# Altium project STM32板.PrjPcb
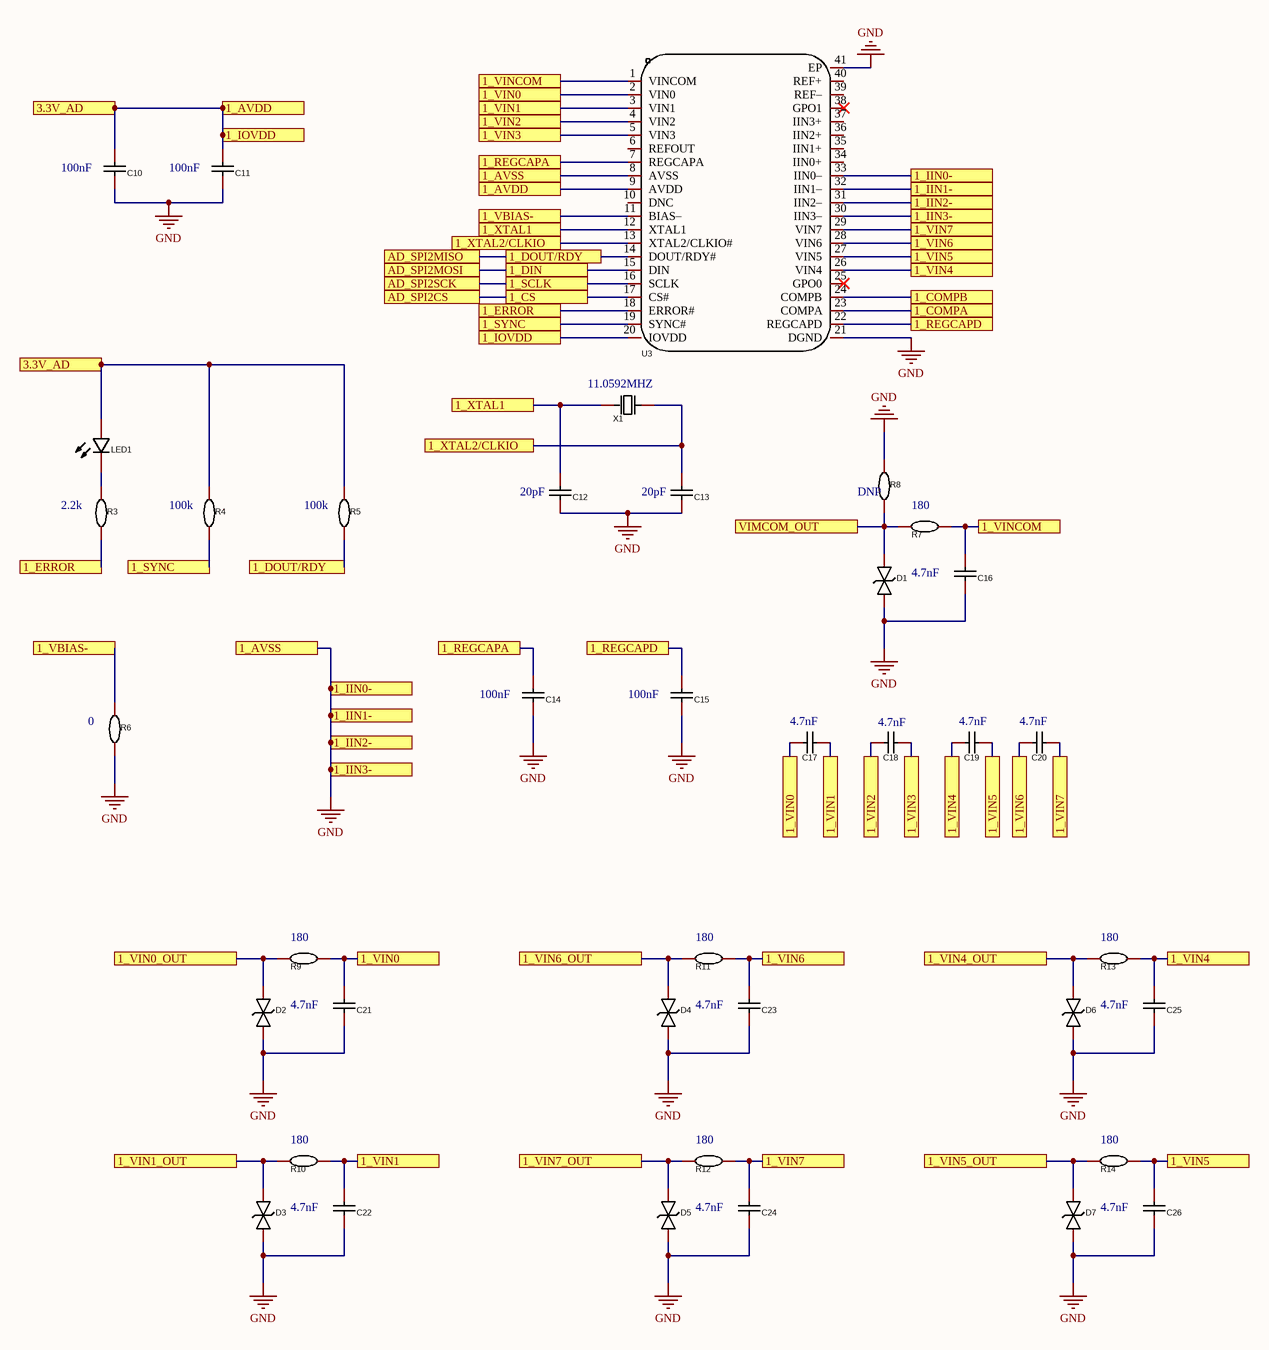
[diagram p0: AD4111_1.SchDoc]
3 sheets, 108 parts. Net scope: flat (ports and power ports of the same name join across sheets).
Board file: PCB1.PcbDoc
Sheets:
  AD4111_1.SchDoc
  AD4111_2.SchDoc
  STM32.SchDoc

## Sheet AD4111_1.SchDoc
size A3; SheetNumber: 1; SheetTotal: 3

### Parts
C10  100nF  [C0603]
C11  100nF  [C0603]
C12  20pF  [C0603]
C13  20pF  [C0603]
C14  100nF  [C0603]
C15  100nF  [C0603]
C16  4.7nF  [C0603]
C17  4.7nF  [C0603]
C18  4.7nF  [C0603]
C19  4.7nF  [C0603]
C20  4.7nF  [C0603]
C21  4.7nF  [C0603]
C22  4.7nF  [C0603]
C23  4.7nF  [C0603]
C24  4.7nF  [C0603]
C25  4.7nF  [C0603]
C26  4.7nF  [C0603]
D1  SMAJ33CA_C908829  [SMA_L4.4-W2.8-LS5.1-BI]  (value not drawn)
D2  SMAJ33CA_C908829  [SMA_L4.4-W2.8-LS5.1-BI]  (value not drawn)
D3  SMAJ33CA_C908829  [SMA_L4.4-W2.8-LS5.1-BI]  (value not drawn)
D4  SMAJ33CA_C908829  [SMA_L4.4-W2.8-LS5.1-BI]  (value not drawn)
D5  SMAJ33CA_C908829  [SMA_L4.4-W2.8-LS5.1-BI]  (value not drawn)
D6  SMAJ33CA_C908829  [SMA_L4.4-W2.8-LS5.1-BI]  (value not drawn)
D7  SMAJ33CA_C908829  [SMA_L4.4-W2.8-LS5.1-BI]  (value not drawn)
LED1  NCD0603R1_C84263  [LED0603-RD_RED]  (value not drawn)
R3  2.2k  [R0603]
R4  100k  [R0603]
R5  100k  [R0603]
R6  0  [R0603]
R7  180  [R0603]
R8  DNP  [R0603]
R9  180  [R0603]
R10  180  [R0603]
R11  180  [R0603]
R12  180  [R0603]
R13  180  [R0603]
R14  180  [R0603]
U3  AD4111BCPZ  [LFCSP-40_L6.0-W6.0-P0.50-TL-EP4.6]  (value not drawn)
X1  11.0592MHZ  [OSC-SMD_L5.0-W3.2]

### Ports
1_AVDD, 1_AVSS, 1_COMPA, 1_COMPB, 1_CS, 1_DIN, 1_DOUT/RDY, 1_ERROR, 1_IIN0-, 1_IIN1-, 1_IIN2-, 1_IIN3-, 1_IOVDD, 1_REGCAPA, 1_REGCAPD, 1_SCLK, 1_SYNC, 1_VBIAS-, 1_VIN0, 1_VIN0_OUT, 1_VIN1, 1_VIN1_OUT, 1_VIN2, 1_VIN3, 1_VIN4, 1_VIN4_OUT, 1_VIN5, 1_VIN5_OUT, 1_VIN6, 1_VIN6_OUT, 1_VIN7, 1_VIN7_OUT, 1_VINCOM, 1_XTAL1, 1_XTAL2/CLKIO, 3.3V_AD, AD_SPI2CS, AD_SPI2MISO, AD_SPI2MOSI, AD_SPI2SCK, VIMCOM_OUT

### Nets
3.3V: C10.2 C11.2 LED1.2(A) R4.2 R5.2 U3.9(AVDD) U3.20(IOVDD) ; port 1_AVDD, port 1_IOVDD, port 3.3V_AD
GND: C10.1 C11.1 C12.1 C13.1 C14.1 C15.1 C16.1 C21.1 C22.1 C23.1 C24.1 C25.1 C26.1 D1.2 D2.2 D3.2 D4.2 D5.2 D6.2 D7.2 R6.1 R8.2 U3.8(AVSS) U3.21(DGND) U3.30(IIN3–) U3.31(IIN2–) U3.32(IIN1–) U3.33(IIN0–) U3.41(EP) ; port 1_AVSS, port 1_IIN0-, port 1_IIN1-, port 1_IIN2-, port 1_IIN3-
PB12: U3.17(CS#) ; port AD_SPI2CS, port 1_CS
PB13: U3.16(SCLK) ; port AD_SPI2SCK, port 1_SCLK
PB14: R5.1 U3.14(DOUT/RDY#) ; port AD_SPI2MISO, port 1_DOUT/RDY
PB15: U3.15(DIN) ; port AD_SPI2MOSI, port 1_DIN
PE0: R4.1 U3.19(SYNC#) ; port 1_SYNC
X3: D2.1 R9.1 ; port 1_VIN0_OUT
Y3: D3.1 R10.1 ; port 1_VIN1_OUT
Z3: D6.1 R13.1 ; port 1_VIN4_OUT
NetC12_2: C12.2 U3.12(XTAL1) X1.1(OSC1) ; port 1_XTAL1
NetC13_2: C13.2 U3.13(XTAL2/CLKIO#) X1.2(OSC2) ; port 1_XTAL2/CLKIO
NetC14_2: C14.2 U3.7(REGCAPA) ; port 1_REGCAPA
NetC15_2: C15.2 U3.22(REGCAPD) ; port 1_REGCAPD
NetC16_2: C16.2 R7.2 U3.1(VINCOM) ; port 1_VINCOM
NetC17_1: C17.1 C21.2 R9.2 U3.2(VIN0) ; port 1_VIN0
NetC17_2: C17.2 C22.2 R10.2 U3.3(VIN1) ; port 1_VIN1
NetC18_1: C18.1 U3.4(VIN2) ; port 1_VIN2
NetC18_2: C18.2 U3.5(VIN3) ; port 1_VIN3
NetC19_1: C19.1 C25.2 R13.2 U3.26(VIN4) ; port 1_VIN4
NetC19_2: C19.2 C26.2 R14.2 U3.27(VIN5) ; port 1_VIN5
NetC20_1: C20.1 C23.2 R11.2 U3.28(VIN6) ; port 1_VIN6
NetC20_2: C20.2 C24.2 R12.2 U3.29(VIN7) ; port 1_VIN7
NetD1_1: D1.1 R7.1 R8.1 ; port VIMCOM_OUT
NetD4_1: D4.1 R11.1 ; port 1_VIN6_OUT
NetD5_1: D5.1 R12.1 ; port 1_VIN7_OUT
NetD7_1: D7.1 R14.1 ; port 1_VIN5_OUT
NetLED1_1: LED1.1(K) R3.2
NetR3_1: R3.1 U3.18(ERROR#) ; port 1_ERROR
NetR6_2: R6.2 U3.11(BIAS–) ; port 1_VBIAS-
NetU3_23: U3.23(COMPA) ; port 1_COMPA
NetU3_24: U3.24(COMPB) ; port 1_COMPB

Not connected (* = marked no-connect by the designer): U3 6(REFOUT) 10(DNC) 25(GPO0)* 34(IIN0+) 35(IIN1+) 36(IIN2+) 37(IIN3+) 38(GPO1)* 39(REF–) 40(REF+)

### Library data of the parts
C10 C11 C14 C15 = 0603B104K500NT: 0603电容; Manufacturer: FH(风华); Add into BOM: yes; Tolerance: ±10%; Voltage Rated: 50V; Temperature Coefficient: X7R; Name: 100nF; Symbol: 0603B104K500NT; Device: 0603B104K500NT; LCSC Part Name: 100nF ±10% 50V; Supplier Part: C30926; Manufacturer Part: 0603B104K500NT; Supplier Footprint: 0603; JLCPCB Part Class: Extended Part; Datasheet: https://atta.szlcsc.com/upload/public/pdf/source/20170923/C30926_1506149436298988724.pdf; Supplier: LCSC; Convert to PCB: yes; Value: 100nF
C12 C13 C16-C26 = 0603B104K500NT: 0603电容; Manufacturer: FH(风华); Name: 100nF; Add into BOM: yes; Value: 100nF; Tolerance: ±10%; Voltage Rated: 50V; Temperature Coefficient: X7R; Symbol: 0603B104K500NT; Device: 0603B104K500NT; LCSC Part Name: 100nF ±10% 50V; Supplier Part: C30926; Manufacturer Part: 0603B104K500NT; Supplier Footprint: 0603; JLCPCB Part Class: Extended Part; Datasheet: https://atta.szlcsc.com/upload/public/pdf/source/20170923/C30926_1506149436298988724.pdf; Supplier: LCSC; Convert to PCB: yes
D1-D7 = SMAJ33CA_C908829: SMAJ33CA; Manufacturer: GOODWORK(固得沃克); Add into BOM: yes; Reverse Stand-Off Voltage (Vrwm): 33V; Maximum Clamping Voltage: 53.3V; Peak Pulse Current (Ipp)@10/1000us: 7.5A; Breakdown Voltage: 36.7V; Reverse Leakage Current (Ir): 5uA; Name: SMAJ33CA; Symbol: SMAJ33CA_C908829; Device: SMAJ33CA_C908829; LCSC Part Name: 双向TVS 33V截止 7.5A峰值脉冲; Supplier Part: C908829; Manufacturer Part: SMAJ33CA; Supplier Footprint: SMA(DO-214AC); JLCPCB Part Class: Extended Part; Datasheet: https://atta.szlcsc.com/upload/public/pdf/source/20201231/C908757_5436EAF671B686EFC2F0DD2098F0ED89.pdf; Supplier: LCSC; Convert to PCB: yes
LED1 = NCD0603R1_C84263: LED; Manufacturer: 国星光电; Symbol: FC-DA1608HRK-620D; Add into BOM: yes; Emitted Color: 红灯; Name: NCD0603R1; Device: NCD0603R1_C84263; LCSC Part Name: 红灯; Supplier Part: C84263; Manufacturer Part: NCD0603R1; Supplier Footprint: 0603; JLCPCB Part Class: Extended Part; Datasheet: https://atta.szlcsc.com/upload/public/pdf/source/20200820/C84263_DABC6A75E58F576973B407FDBA283D60.pdf; Supplier: LCSC; Convert to PCB: yes
R3-R14 = 0603WAF1002T5E: 0603电阻; Manufacturer: UNI-ROYAL(厚声); Name: 10kΩ; Add into BOM: yes; Value: 10kΩ; Tolerance: ±1%; Power(Watts): 100mW; Temperature Coefficient: ±100ppm/℃; Overload Voltage (Max): 75V; Symbol: 0603WAF1002T5E; Device: 0603WAF1002T5E; LCSC Part Name: 厚膜电阻 10kΩ ±1% 100mW; Supplier Part: C25804; Manufacturer Part: 0603WAF1002T5E; Supplier Footprint: 0603; JLCPCB Part Class: Basic Part; Datasheet: https://atta.szlcsc.com/upload/public/pdf/source/20200306/C422600_1E6D84923E4A46A82E41ADD87F860B5C.pdf; Supplier: LCSC; Convert to PCB: yes; Type: 厚膜电阻; Operating Temperature Range: -55℃~+155℃
U3 = AD4111BCPZ: Manufacturer: ADI(亚德诺); Add into BOM: yes; Interface: 串行；SPI; differential input: 是; number of channels: 4；8; sampling frequency: 6.2kHz; resolution: 24位; Supply Voltage: 2V~5.5V; Name: AD4111BCPZ; Symbol: AD4111BCPZ; Device: AD4111BCPZ; LCSC Part Name: AD4111BCPZ; Supplier Part: C649166; Manufacturer Part: AD4111BCPZ; Supplier Footprint: LFCSP-40; JLCPCB Part Class: Extended Part; Datasheet: https://atta.szlcsc.com/upload/public/pdf/source/20220519/010EE3C44EFBAA26D33F75A00EF652F8.pdf; Supplier: LCSC; Convert to PCB: yes; Operating Temperature: -40℃~+105℃
X1 = X5032110592MSB2GI: 11.0592MHZ晶振; Manufacturer: YXC(扬兴晶振); Add into BOM: yes; Crystal Type: 贴片无源晶振; Load Capacitance: 20pF; Frequency Tolerance: ±10ppm; Frequency Stability: ±50ppm; Name: 11.0592MHz; Symbol: X5032110592MSB2GI; Device: X5032110592MSB2GI; LCSC Part Name: 11.0592MHz ±10ppm 20pF YSX530GA; Supplier Part: C112574; Manufacturer Part: X5032110592MSB2GI; Supplier Footprint: SMD5032-2P; JLCPCB Part Class: Basic Part; Datasheet: https://atta.szlcsc.com/upload/public/pdf/source/20210329/C112559_847D3CACBA33ACCEB57DEA3AEBB187A1.pdf; Supplier: LCSC; Convert to PCB: yes; Value: 11.0592MHz; Operating Temperature: -40℃~+85℃

## Sheet AD4111_2.SchDoc
size A3; SheetNumber: 2; SheetTotal: 3
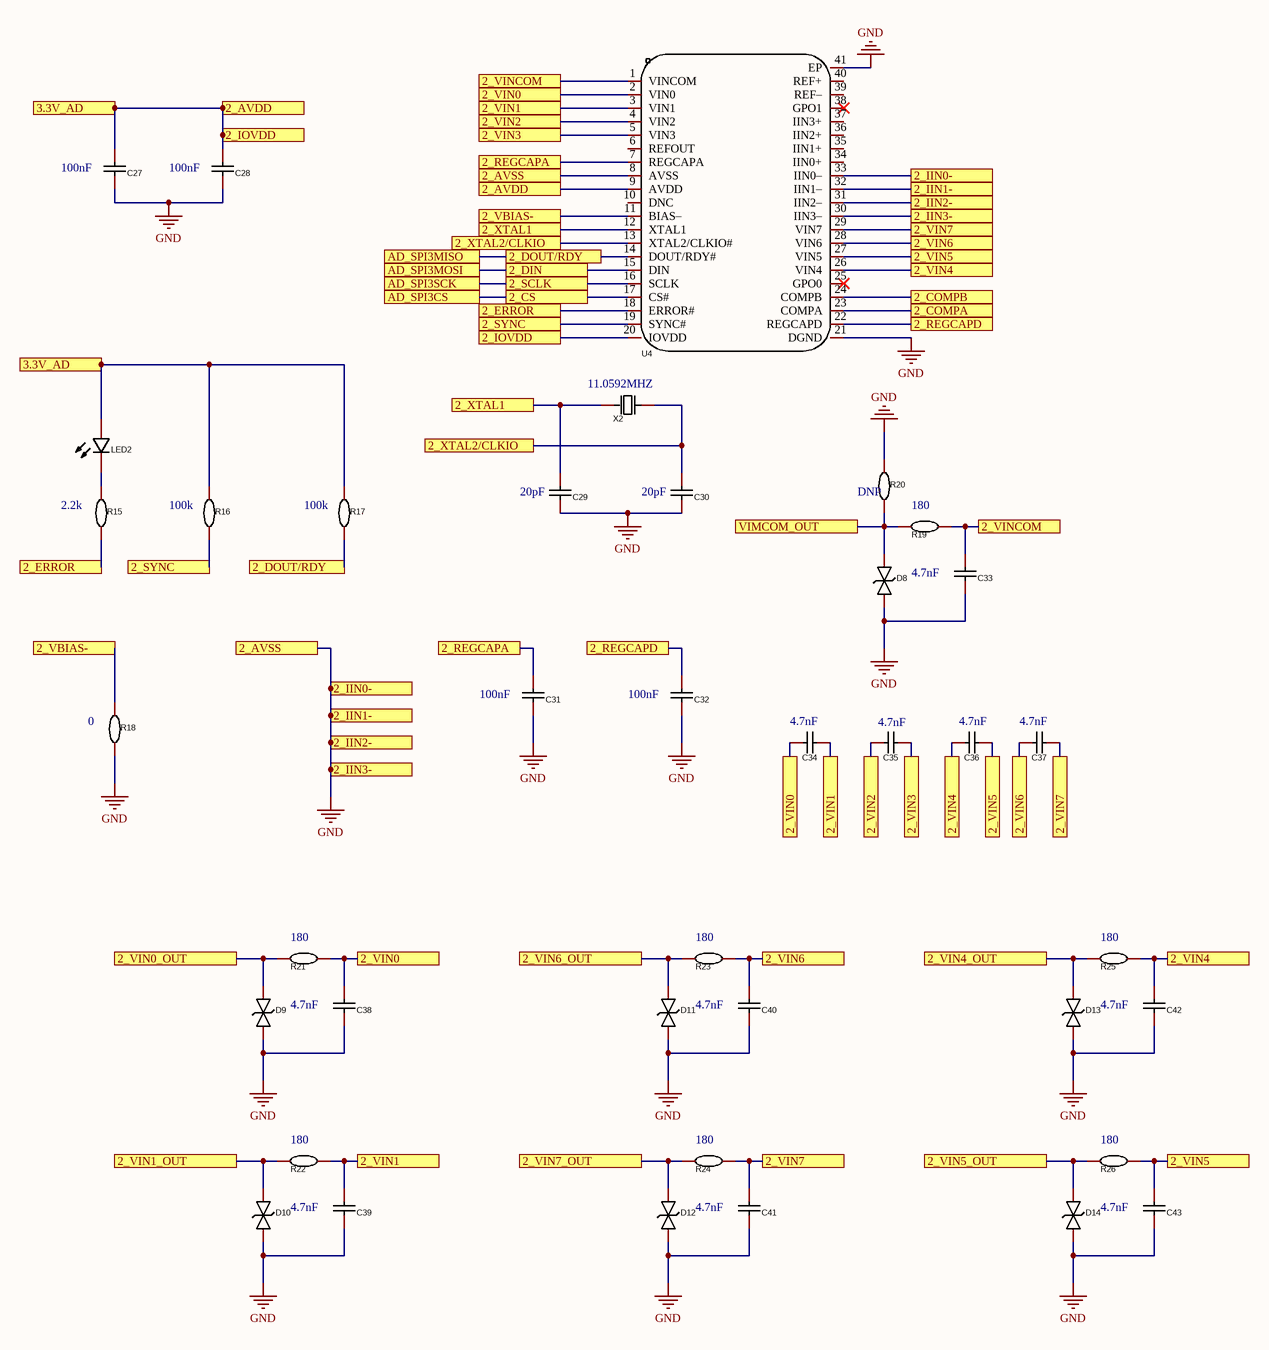
[diagram p1: AD4111_2.SchDoc]

### Parts
C27  100nF  [C0603]
C28  100nF  [C0603]
C29  20pF  [C0603]
C30  20pF  [C0603]
C31  100nF  [C0603]
C32  100nF  [C0603]
C33  4.7nF  [C0603]
C34  4.7nF  [C0603]
C35  4.7nF  [C0603]
C36  4.7nF  [C0603]
C37  4.7nF  [C0603]
C38  4.7nF  [C0603]
C39  4.7nF  [C0603]
C40  4.7nF  [C0603]
C41  4.7nF  [C0603]
C42  4.7nF  [C0603]
C43  4.7nF  [C0603]
D8  SMAJ33CA_C908829  [SMA_L4.4-W2.8-LS5.1-BI]  (value not drawn)
D9  SMAJ33CA_C908829  [SMA_L4.4-W2.8-LS5.1-BI]  (value not drawn)
D10  SMAJ33CA_C908829  [SMA_L4.4-W2.8-LS5.1-BI]  (value not drawn)
D11  SMAJ33CA_C908829  [SMA_L4.4-W2.8-LS5.1-BI]  (value not drawn)
D12  SMAJ33CA_C908829  [SMA_L4.4-W2.8-LS5.1-BI]  (value not drawn)
D13  SMAJ33CA_C908829  [SMA_L4.4-W2.8-LS5.1-BI]  (value not drawn)
D14  SMAJ33CA_C908829  [SMA_L4.4-W2.8-LS5.1-BI]  (value not drawn)
LED2  NCD0603R1_C84263  [LED0603-RD_RED]  (value not drawn)
R15  2.2k  [R0603]
R16  100k  [R0603]
R17  100k  [R0603]
R18  0  [R0603]
R19  180  [R0603]
R20  DNP  [R0603]
R21  180  [R0603]
R22  180  [R0603]
R23  180  [R0603]
R24  180  [R0603]
R25  180  [R0603]
R26  180  [R0603]
U4  AD4111BCPZ  [LFCSP-40_L6.0-W6.0-P0.50-TL-EP4.6]  (value not drawn)
X2  11.0592MHZ  [OSC-SMD_L5.0-W3.2]

### Ports
2_AVDD, 2_AVSS, 2_COMPA, 2_COMPB, 2_CS, 2_DIN, 2_DOUT/RDY, 2_ERROR, 2_IIN0-, 2_IIN1-, 2_IIN2-, 2_IIN3-, 2_IOVDD, 2_REGCAPA, 2_REGCAPD, 2_SCLK, 2_SYNC, 2_VBIAS-, 2_VIN0, 2_VIN0_OUT, 2_VIN1, 2_VIN1_OUT, 2_VIN2, 2_VIN3, 2_VIN4, 2_VIN4_OUT, 2_VIN5, 2_VIN5_OUT, 2_VIN6, 2_VIN6_OUT, 2_VIN7, 2_VIN7_OUT, 2_VINCOM, 2_XTAL1, 2_XTAL2/CLKIO, 3.3V_AD, AD_SPI3CS, AD_SPI3MISO, AD_SPI3MOSI, AD_SPI3SCK, VIMCOM_OUT

### Nets
3.3V: C27.2 C28.2 LED2.2(A) R16.2 R17.2 U4.9(AVDD) U4.20(IOVDD) ; port 2_AVDD, port 2_IOVDD, port 3.3V_AD
GND: C27.1 C28.1 C29.1 C30.1 C31.1 C32.1 C33.1 C38.1 C39.1 C40.1 C41.1 C42.1 C43.1 D8.2 D9.2 D10.2 D11.2 D12.2 D13.2 D14.2 R18.1 R20.2 U4.8(AVSS) U4.21(DGND) U4.30(IIN3–) U4.31(IIN2–) U4.32(IIN1–) U4.33(IIN0–) U4.41(EP) ; port 2_AVSS, port 2_IIN0-, port 2_IIN1-, port 2_IIN2-, port 2_IIN3-
PB3: U4.16(SCLK) ; port AD_SPI3SCK, port 2_SCLK
PB4: R17.1 U4.14(DOUT/RDY#) ; port AD_SPI3MISO, port 2_DOUT/RDY
PB5: U4.15(DIN) ; port AD_SPI3MOSI, port 2_DIN
PD7: U4.17(CS#) ; port AD_SPI3CS, port 2_CS
PE0: R16.1 U4.19(SYNC#) ; port 2_SYNC
X1: D9.1 R21.1 ; port 2_VIN0_OUT
X2: D14.1 R26.1 ; port 2_VIN5_OUT
Y1: D10.1 R22.1 ; port 2_VIN1_OUT
Y2: D11.1 R23.1 ; port 2_VIN6_OUT
Z1: D13.1 R25.1 ; port 2_VIN4_OUT
Z2: D12.1 R24.1 ; port 2_VIN7_OUT
NetC29_2: C29.2 U4.12(XTAL1) X2.1(OSC1) ; port 2_XTAL1
NetC30_2: C30.2 U4.13(XTAL2/CLKIO#) X2.2(OSC2) ; port 2_XTAL2/CLKIO
NetC31_2: C31.2 U4.7(REGCAPA) ; port 2_REGCAPA
NetC32_2: C32.2 U4.22(REGCAPD) ; port 2_REGCAPD
NetC33_2: C33.2 R19.2 U4.1(VINCOM) ; port 2_VINCOM
NetC34_1: C34.1 C38.2 R21.2 U4.2(VIN0) ; port 2_VIN0
NetC34_2: C34.2 C39.2 R22.2 U4.3(VIN1) ; port 2_VIN1
NetC35_1: C35.1 U4.4(VIN2) ; port 2_VIN2
NetC35_2: C35.2 U4.5(VIN3) ; port 2_VIN3
NetC36_1: C36.1 C42.2 R25.2 U4.26(VIN4) ; port 2_VIN4
NetC36_2: C36.2 C43.2 R26.2 U4.27(VIN5) ; port 2_VIN5
NetC37_1: C37.1 C40.2 R23.2 U4.28(VIN6) ; port 2_VIN6
NetC37_2: C37.2 C41.2 R24.2 U4.29(VIN7) ; port 2_VIN7
NetD1_1: D8.1 R19.1 R20.1 ; port VIMCOM_OUT
NetLED2_1: LED2.1(K) R15.2
NetR15_1: R15.1 U4.18(ERROR#) ; port 2_ERROR
NetR18_2: R18.2 U4.11(BIAS–) ; port 2_VBIAS-
NetU4_23: U4.23(COMPA) ; port 2_COMPA
NetU4_24: U4.24(COMPB) ; port 2_COMPB

Not connected (* = marked no-connect by the designer): U4 6(REFOUT) 10(DNC) 25(GPO0)* 34(IIN0+) 35(IIN1+) 36(IIN2+) 37(IIN3+) 38(GPO1)* 39(REF–) 40(REF+)

### Library data of the parts
C27 C28 C31 C32 = 0603B104K500NT: as C10 on sheet AD4111_1; Name: 100nF; Symbol: 0603B104K500NT; Device: 0603B104K500NT; LCSC Part Name: 100nF ±10% 50V; Supplier Part: C30926; Manufacturer Part: 0603B104K500NT; Supplier Footprint: 0603; JLCPCB Part Class: Extended Part; Datasheet: https://atta.szlcsc.com/upload/public/pdf/source/20170923/C30926_1506149436298988724.pdf; Supplier: LCSC; Convert to PCB: yes; Value: 100nF
C29 C30 C33-C43 = 0603B104K500NT: as C12 on sheet AD4111_1; Symbol: 0603B104K500NT; Device: 0603B104K500NT; LCSC Part Name: 100nF ±10% 50V; Supplier Part: C30926; Manufacturer Part: 0603B104K500NT; Supplier Footprint: 0603; JLCPCB Part Class: Extended Part; Datasheet: https://atta.szlcsc.com/upload/public/pdf/source/20170923/C30926_1506149436298988724.pdf; Supplier: LCSC; Convert to PCB: yes
D8-D14 = SMAJ33CA_C908829: as D1 on sheet AD4111_1; Name: SMAJ33CA; Symbol: SMAJ33CA_C908829; Device: SMAJ33CA_C908829; LCSC Part Name: 双向TVS 33V截止 7.5A峰值脉冲; Supplier Part: C908829; Manufacturer Part: SMAJ33CA; Supplier Footprint: SMA(DO-214AC); JLCPCB Part Class: Extended Part; Datasheet: https://atta.szlcsc.com/upload/public/pdf/source/20201231/C908757_5436EAF671B686EFC2F0DD2098F0ED89.pdf; Supplier: LCSC; Convert to PCB: yes
LED2 = NCD0603R1_C84263: as LED1 on sheet AD4111_1; Name: NCD0603R1; Device: NCD0603R1_C84263; LCSC Part Name: 红灯; Supplier Part: C84263; Manufacturer Part: NCD0603R1; Supplier Footprint: 0603; JLCPCB Part Class: Extended Part; Datasheet: https://atta.szlcsc.com/upload/public/pdf/source/20200820/C84263_DABC6A75E58F576973B407FDBA283D60.pdf; Supplier: LCSC; Convert to PCB: yes
R15-R26 = 0603WAF1002T5E: as R3 on sheet AD4111_1; Symbol: 0603WAF1002T5E; Device: 0603WAF1002T5E; LCSC Part Name: 厚膜电阻 10kΩ ±1% 100mW; Supplier Part: C25804; Manufacturer Part: 0603WAF1002T5E; Supplier Footprint: 0603; JLCPCB Part Class: Basic Part; Datasheet: https://atta.szlcsc.com/upload/public/pdf/source/20200306/C422600_1E6D84923E4A46A82E41ADD87F860B5C.pdf; Supplier: LCSC; Convert to PCB: yes; Type: 厚膜电阻; Operating Temperature Range: -55℃~+155℃
U4 = AD4111BCPZ: as U3 on sheet AD4111_1; Name: AD4111BCPZ; Symbol: AD4111BCPZ; Device: AD4111BCPZ; LCSC Part Name: AD4111BCPZ; Supplier Part: C649166; Manufacturer Part: AD4111BCPZ; Supplier Footprint: LFCSP-40; JLCPCB Part Class: Extended Part; Datasheet: https://atta.szlcsc.com/upload/public/pdf/source/20220519/010EE3C44EFBAA26D33F75A00EF652F8.pdf; Supplier: LCSC; Convert to PCB: yes; Operating Temperature: -40℃~+105℃
X2 = X5032110592MSB2GI: as X1 on sheet AD4111_1; Name: 11.0592MHz; Symbol: X5032110592MSB2GI; Device: X5032110592MSB2GI; LCSC Part Name: 11.0592MHz ±10ppm 20pF YSX530GA; Supplier Part: C112574; Manufacturer Part: X5032110592MSB2GI; Supplier Footprint: SMD5032-2P; JLCPCB Part Class: Basic Part; Datasheet: https://atta.szlcsc.com/upload/public/pdf/source/20210329/C112559_847D3CACBA33ACCEB57DEA3AEBB187A1.pdf; Supplier: LCSC; Convert to PCB: yes; Value: 11.0592MHz; Operating Temperature: -40℃~+85℃

## Sheet STM32.SchDoc
size A3; SheetNumber: 3; SheetTotal: 3
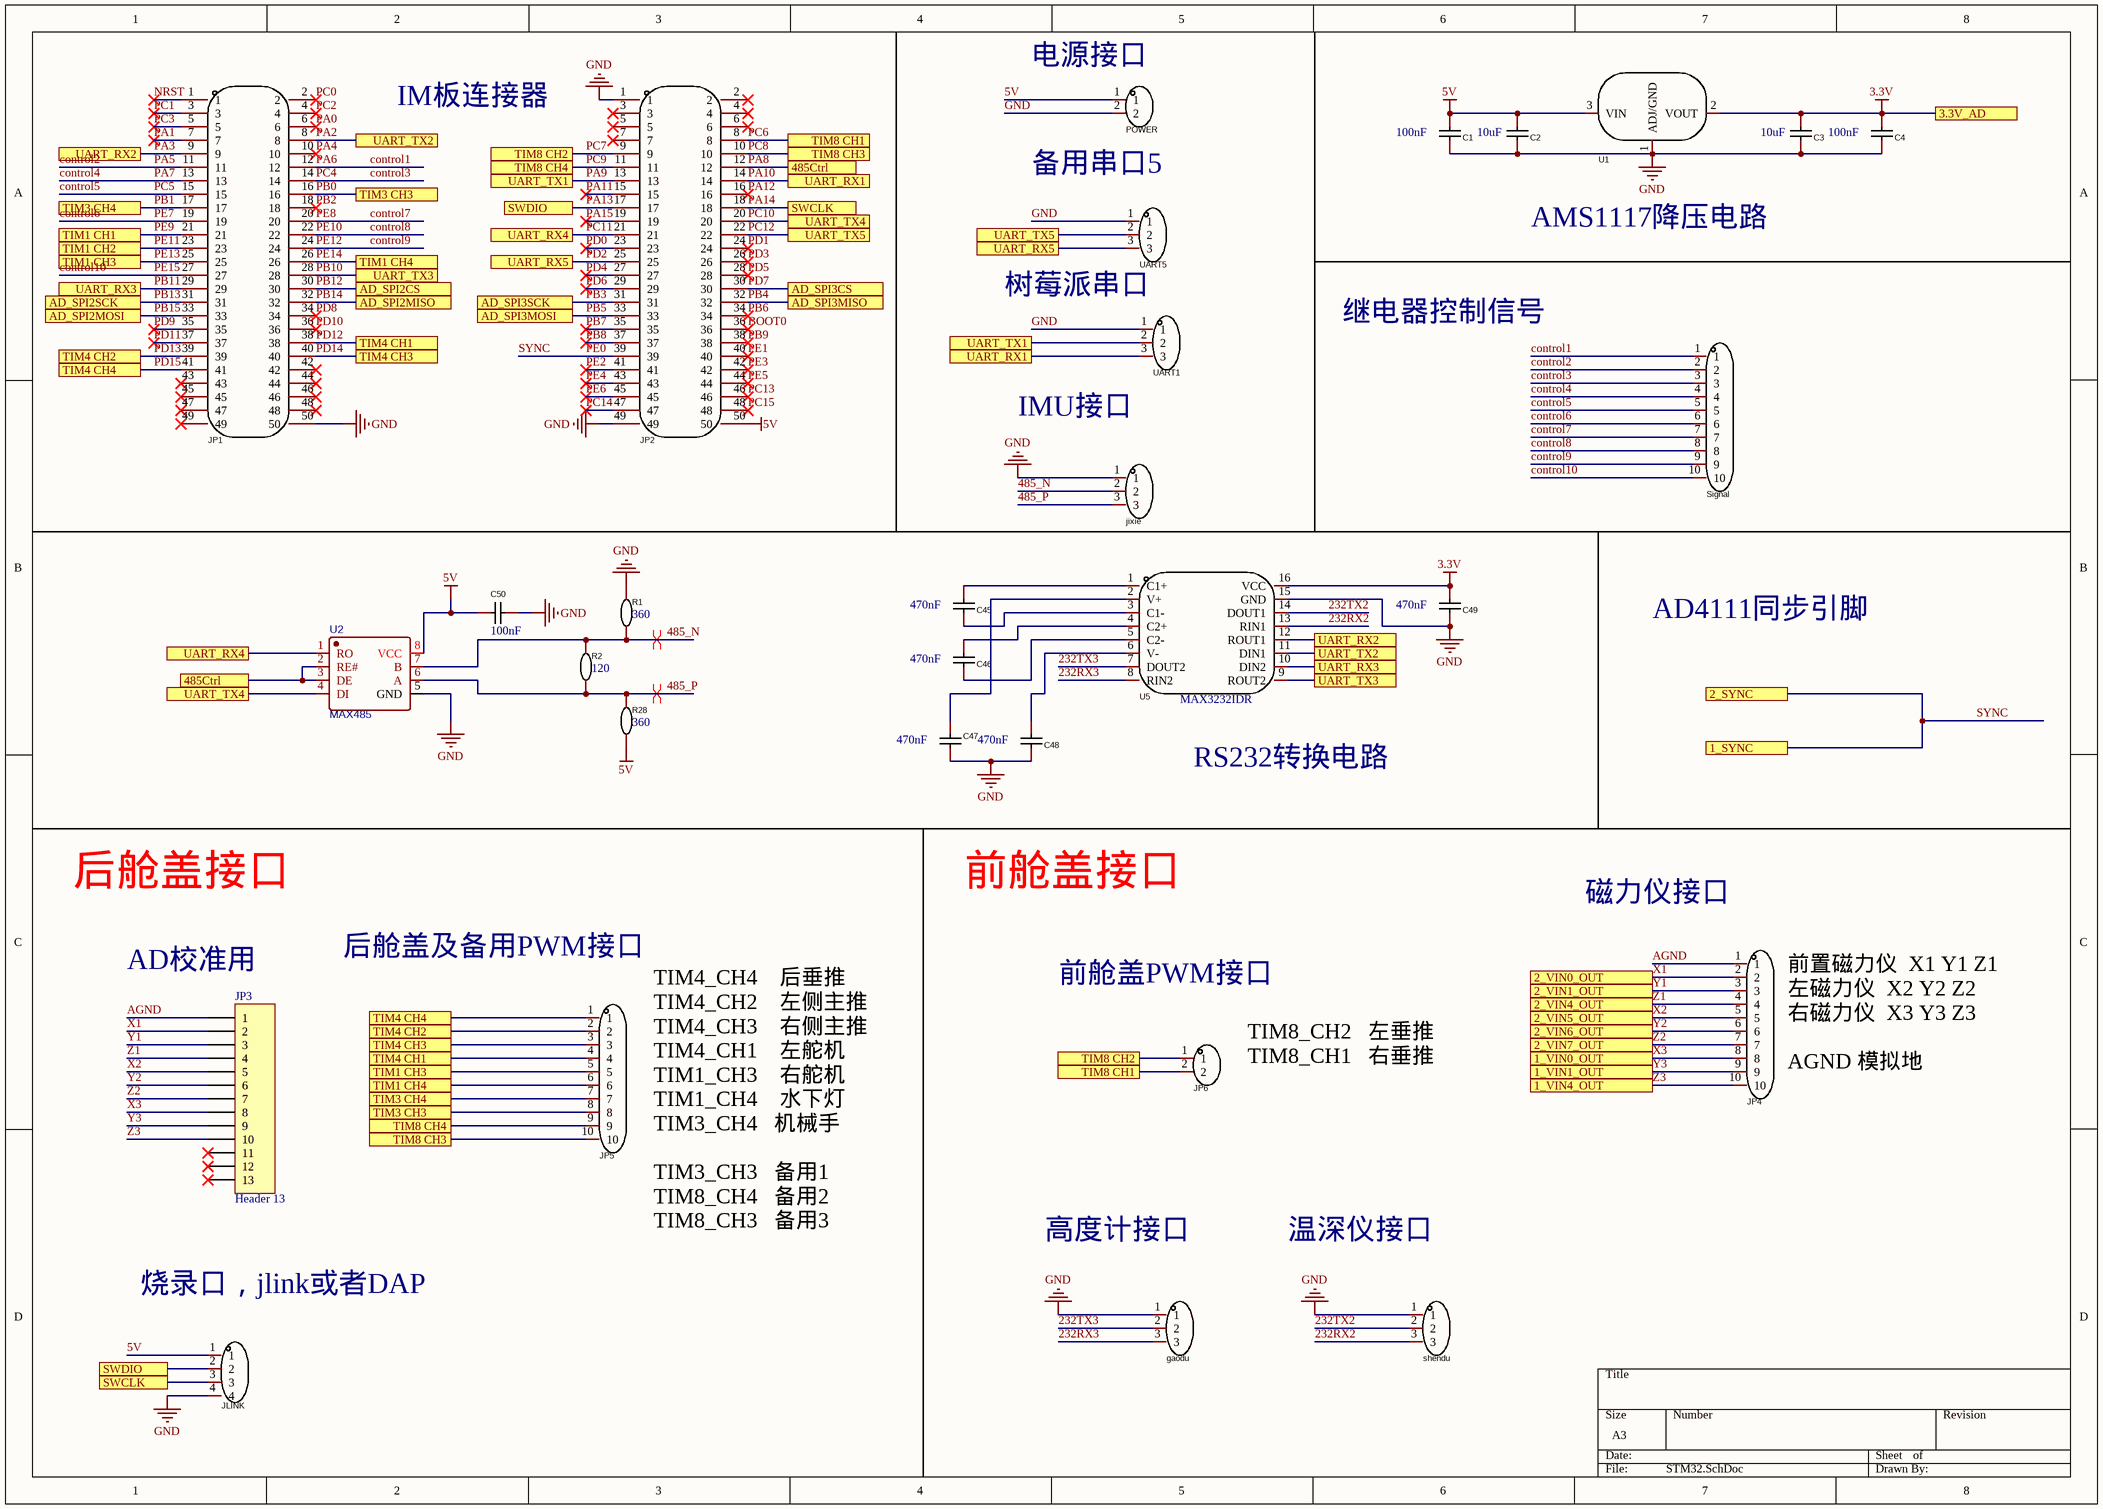
[diagram p2: STM32.SchDoc]

### Parts
C1  100nF  [C0603]
C2  10uF  [C0603]
C3  10uF  [C0603]
C4  100nF  [C0603]
C45  470nF  [C0603]
C46  470nF  [C0603]
C47  470nF  [C0603]
C48  470nF  [C0603]
C49  470nF  [C0603]
C50  100nF  [C0603]
gaodu  KF2EDGR-3.81-3P  [CONN-TH_3P-P3.81_KF2EDGR-3.81-3P]  (value not drawn)
jixie  KF2EDGR-3.81-3P  [CONN-TH_3P-P3.81_KF2EDGR-3.81-3P]  (value not drawn)
JLINK  XH-4AW  [CONN-TH_XH-4AW]  (value not drawn)
JP1  2685Y-225CNG1SNA01  [HDR-TH_50P-P2.54-V-F-R2-C25-S2.54-1]  (value not drawn)
JP2  2685Y-225CNG1SNA01  [HDR-TH_50P-P2.54-V-F-R2-C25-S2.54-1]  (value not drawn)
JP3  Header 13  [HDR1X13]
JP4  KF2EDGR-3.5-10P  [CONN-TH_10P-P3.50_KF2EDGR-3.5-10P]  (value not drawn)
JP5  KF2EDGR-3.5-10P  [CONN-TH_10P-P3.50_KF2EDGR-3.5-10P]  (value not drawn)
JP6  KF2EDGR-3.81-2P  [CONN-TH_2P-P3.81_KF2EDGR-3.81-2P]  (value not drawn)
POWER  KF2EDGR-3.81-2P  [CONN-TH_2P-P3.81_KF2EDGR-3.81-2P]  (value not drawn)
R1  360  [R0603]
R2  120  [R0603]
R28  360  [R0603]
shendu  KF2EDGR-3.81-3P  [CONN-TH_3P-P3.81_KF2EDGR-3.81-3P]  (value not drawn)
Signal  KF2EDGR-3.5-10P  [CONN-TH_10P-P3.50_KF2EDGR-3.5-10P]  (value not drawn)
U1  A1117-3.3  [SOT-223-3_L6.5-W3.4-P2.30-LS7.0-BR-1]  (value not drawn)
U2  MAX485  [SOIC-8_150MIL]
U5  MAX3232IDR  [SOIC-16_L9.9-W3.9-P1.27-LS6.0-BL]
UART1  KF2EDGR-3.81-3P  [CONN-TH_3P-P3.81_KF2EDGR-3.81-3P]  (value not drawn)
UART5  KF2EDGR-3.81-3P  [CONN-TH_3P-P3.81_KF2EDGR-3.81-3P]  (value not drawn)

### Ports
1_SYNC, 1_VIN0_OUT, 1_VIN1_OUT, 1_VIN4_OUT, 2_SYNC, 2_VIN0_OUT, 2_VIN1_OUT, 2_VIN4_OUT, 2_VIN5_OUT, 2_VIN6_OUT, 2_VIN7_OUT, 3.3V_AD, 485Ctrl, AD_SPI2CS, AD_SPI2MISO, AD_SPI2MOSI, AD_SPI2SCK, AD_SPI3CS, AD_SPI3MISO, AD_SPI3MOSI, AD_SPI3SCK, SWCLK, SWDIO, TIM1 CH1, TIM1 CH2, TIM1 CH3, TIM1 CH4, TIM3 CH3, TIM3 CH4, TIM4 CH1, TIM4 CH2, TIM4 CH3, TIM4 CH4, TIM8 CH1, TIM8 CH2, TIM8 CH3, TIM8 CH4, UART_RX1, UART_RX2, UART_RX3, UART_RX4, UART_RX5, UART_TX1, UART_TX2, UART_TX3, UART_TX4, UART_TX5

### Nets
3.3V: C3.2 C4.2 C49.2 U1.2(VOUT) U5.16(VCC) ; port 3.3V_AD
5V: C1.1 C2.1 C50.2 JLINK.1 JP2.50 POWER.1 R28.1 U1.3(VIN) U2.8(VCC)
GND: C1.2 C2.2 C3.1 C4.1 C47.1 C48.1 C49.1 C50.1 gaodu.1 jixie.1 JLINK.4 JP1.50 JP2.1 JP2.49 POWER.2 R1.2 shendu.1 U1.1(ADJ/GND) U2.5(GND) U5.15(GND) UART1.1 UART5.1
232RX2: shendu.3 U5.13(RIN1)
232RX3: gaodu.3 U5.8(RIN2)
232TX2: shendu.2 U5.14(DOUT1)
232TX3: gaodu.2 U5.7(DOUT2)
485_N: jixie.2 R1.1 R2.2 U2.7(B)
485_P: jixie.3 R2.1 R28.2 U2.6(A)
AGND: JP3.1 JP4.1
BOOT0: JP2.36
control1: JP1.12 Signal.1  [also labelled PA6]
control2: JP1.11 Signal.2  [also labelled PA5]
control3: JP1.14 Signal.3  [also labelled PC4]
control4: JP1.13 Signal.4  [also labelled PA7]
control5: JP1.15 Signal.5  [also labelled PC5]
control6: JP1.19 Signal.6  [also labelled PE7]
control7: JP1.20 Signal.7  [also labelled PE8]
control8: JP1.22 Signal.8  [also labelled PE10]
control9: JP1.24 Signal.9  [also labelled PE12]
control10: JP1.27 Signal.10  [also labelled PE15]
NRST: JP1.1
PA0: JP1.6
PA1: JP1.7
PA2: JP1.8 U5.11(DIN1) ; port UART_TX2
PA3: JP1.9 U5.12(ROUT1) ; port UART_RX2
PA4: JP1.10
PA8: JP2.12 U2.2(RE#) U2.3(DE) ; port 485Ctrl
PA9: JP2.13 UART1.2 ; port UART_TX1
PA10: JP2.14 UART1.3 ; port UART_RX1
PA11: JP2.15
PA12: JP2.16
PA13: JLINK.2 JP2.17 ; port SWDIO
PA14: JLINK.3 JP2.18 ; port SWCLK
PA15: JP2.19
PB0: JP1.16 JP5.8 ; port TIM3 CH3
PB1: JP1.17 JP5.7 ; port TIM3 CH4
PB2: JP1.18
PB3: JP2.31 ; port AD_SPI3SCK
PB4: JP2.32 ; port AD_SPI3MISO
PB5: JP2.33 ; port AD_SPI3MOSI
PB6: JP2.34
PB7: JP2.35
PB8: JP2.37
PB9: JP2.38
PB10: JP1.28 U5.9(ROUT2) ; port UART_TX3
PB11: JP1.29 U5.10(DIN2) ; port UART_RX3
PB12: JP1.30 ; port AD_SPI2CS
PB13: JP1.31 ; port AD_SPI2SCK
PB14: JP1.32 ; port AD_SPI2MISO
PB15: JP1.33 ; port AD_SPI2MOSI
PC0: JP1.2
PC1: JP1.3
PC2: JP1.4
PC3: JP1.5
PC6: JP2.8 JP6.2 ; port TIM8 CH1
PC7: JP2.9 JP6.1 ; port TIM8 CH2
PC8: JP2.10 JP5.10 ; port TIM8 CH3
PC9: JP2.11 JP5.9 ; port TIM8 CH4
PC10: JP2.20 U2.4(DI) ; port UART_TX4
PC11: JP2.21 U2.1(RO) ; port UART_RX4
PC12: JP2.22 UART5.2 ; port UART_TX5
PC13: JP2.46
PC14: JP2.47
PC15: JP2.48
PD0: JP2.23
PD1: JP2.24
PD2: JP2.25 UART5.3 ; port UART_RX5
PD3: JP2.26
PD4: JP2.27
PD5: JP2.28
PD6: JP2.29
PD7: JP2.30 ; port AD_SPI3CS
PD8: JP1.34
PD9: JP1.35
PD10: JP1.36
PD11: JP1.37
PD12: JP1.38 JP5.4 ; port TIM4 CH1
PD13: JP1.39 JP5.2 ; port TIM4 CH2
PD14: JP1.40 JP5.3 ; port TIM4 CH3
PD15: JP1.41 JP5.1 ; port TIM4 CH4
PE0: JP2.39 ; port 2_SYNC, port 1_SYNC  [also labelled SYNC]
PE1: JP2.40
PE2: JP2.41
PE3: JP2.42
PE4: JP2.43
PE5: JP2.44
PE6: JP2.45
PE9: JP1.21 ; port TIM1 CH1
PE11: JP1.23 ; port TIM1 CH2
PE13: JP1.25 JP5.5 ; port TIM1 CH3
PE14: JP1.26 JP5.6 ; port TIM1 CH4
X1: JP3.2 JP4.2 ; port 2_VIN0_OUT
X2: JP3.5 JP4.5 ; port 2_VIN5_OUT
X3: JP3.8 JP4.8 ; port 1_VIN0_OUT
Y1: JP3.3 JP4.3 ; port 2_VIN1_OUT
Y2: JP3.6 JP4.6 ; port 2_VIN6_OUT
Y3: JP3.9 JP4.9 ; port 1_VIN1_OUT
Z1: JP3.4 JP4.4 ; port 2_VIN4_OUT
Z2: JP3.7 JP4.7 ; port 2_VIN7_OUT
Z3: JP3.10 JP4.10 ; port 1_VIN4_OUT
NetC45_1: C45.1 U5.3(C1-)
NetC45_2: C45.2 U5.1(C1+)
NetC46_1: C46.1 U5.5(C2-)
NetC46_2: C46.2 U5.4(C2+)
NetC47_2: C47.2 U5.2(V+)
NetC48_2: C48.2 U5.6(V-)

Not connected (* = marked no-connect by the designer): JP1 42* 43* 44* 45* 46* 47* 48* 49*; JP2 2* 3* 4* 5* 6* 7*; JP3 11* 12* 13*

### Layout directives
differential pair: 485_N, 485_P

### Notes on the sheet
- IM板连接器
- (near POWER) 电源接口
- 备用串口5
- AMS1117降压电路
- 树莓派串口
- 继电器控制信号
- IMU接口
- AD4111同步引脚
- RS232转换电路
- 后舱盖接口
- 前舱盖接口
- 磁力仪接口
- (near JP3) AD校准用
- 后舱盖及备用PWM接口
- 前舱盖PWM接口
- TIM8_CH2   左垂推
  TIM8_CH1   右垂推
- (near JP4) 前置磁力仪  X1 Y1 Z1
  左磁力仪  X2 Y2 Z2
  右磁力仪  X3 Y3 Z3
  AGND 模拟地
- TIM4_CH4    后垂推
  TIM4_CH2    左侧主推
  TIM4_CH3    右侧主推
  TIM4_CH1    左舵机
  TIM1_CH3    右舵机
  TIM1_CH4    水下灯
  TIM3_CH4   机械手
  TIM3_CH3   备用1
  TIM8_CH4   备用2
  TIM8_CH3   备用3
- 高度计接口
- 温深仪接口
- 烧录口，jlink或者DAP

### Library data of the parts
C1 C4 C50 = 0603B104K500NT: as C10 on sheet AD4111_1; Name: 100nF; Symbol: 0603B104K500NT; Device: 0603B104K500NT; LCSC Part Name: 100nF ±10% 50V; Supplier Part: C30926; Manufacturer Part: 0603B104K500NT; Supplier Footprint: 0603; JLCPCB Part Class: Extended Part; Datasheet: https://atta.szlcsc.com/upload/public/pdf/source/20170923/C30926_1506149436298988724.pdf; Supplier: LCSC; Convert to PCB: yes; Value: 100nF
C2 C3 C45-C49 = 0603B104K500NT: as C12 on sheet AD4111_1; Symbol: 0603B104K500NT; Device: 0603B104K500NT; LCSC Part Name: 100nF ±10% 50V; Supplier Part: C30926; Manufacturer Part: 0603B104K500NT; Supplier Footprint: 0603; JLCPCB Part Class: Extended Part; Datasheet: https://atta.szlcsc.com/upload/public/pdf/source/20170923/C30926_1506149436298988724.pdf; Supplier: LCSC; Convert to PCB: yes
gaodu jixie shendu UART1 UART5 = KF2EDGR-3.81-3P: Manufacturer: KEFA(科发); Add into BOM: yes; Connector Type: 板端/插座-闭口; Pitch: 3.81mm; Number of PINs Per Row: 3; Current Rating (Max): 8A; Voltage Rating (Max): 300V; Name: KF2EDGR-3.81-3P; Symbol: KF2EDGR-3.81-3P; Device: KF2EDGR-3.81-3P; LCSC Part Name: 板端/插座-闭口 3.81mm 排数:1 每排P数:3 弯针; Supplier Part: C441183; Manufacturer Part: KF2EDGR-3.81-3P; Supplier Footprint: P=3.81mm; JLCPCB Part Class: Extended Part; Datasheet: https://atta.szlcsc.com/upload/public/pdf/source/20191023/C441183_0DEFA45C98AD039C055774507C9A3105.pdf; Supplier: LCSC; Convert to PCB: yes; Number of Rows: 1; Mounting Style: 弯针; Wire Gauge - AWG: -; Wire Gauge - mm?: -; Operating Temperature Range: -40℃~+105℃; Color: 绿色
JLINK = XH-4AW: XH2.54-4P弯针; Manufacturer: HCTL(华灿天禄); Symbol: XH-4AW_C2908613; Add into BOM: yes; Pins Structure: 1x4P; Pitch: 2.54mm; Reference Series: XH; Number of PINs Per Row: 4; Current Rating (Max): 3A; Name: XH-4AW; Device: XH-4AW; LCSC Part Name: 1x4P 间距:2.54mm 弯插 系列:XH; Supplier Part: C2908613; Manufacturer Part: XH-4AW; Supplier Footprint: 弯插,P=2.54mm; JLCPCB Part Class: Extended Part; Datasheet: https://atta.szlcsc.com/upload/public/pdf/source/20230711/B565BAF3B11666EF6B81B3605408F2BD.pdf; Supplier: LCSC; Convert to PCB: yes; Mounting Style: 弯插; Number of Pins: 4P; Number of Rows: 1; Row Spacing: -; Contact Material: 黄铜; Contact Plating: 锡; Operating Temperature Range: -25℃~+85℃
JP1 JP2 = 2685Y-225CNG1SNA01: Manufacturer: 华宇创; Add into BOM: yes; Number of Holes: 50P; Pitch: 2.54mm; Holes Structure: 2x25P; Name: 2685Y-225CNG1SNA01; Symbol: 2685Y-225CNG1SNA01; Device: 2685Y-225CNG1SNA01; LCSC Part Name: 2.54mm 2x25P Y型//环保耐高温/镀金; Supplier Part: C350296; Manufacturer Part: 2685Y-225CNG1SNA01; Supplier Footprint: 插件,P=2.54mm; JLCPCB Part Class: Extended Part; Datasheet: https://atta.szlcsc.com/upload/public/pdf/source/20181220/C350296_D2530F60C4B7AD26B2D0A354C76F8429.pdf; Supplier: LCSC; Convert to PCB: yes; Number of Rows: 双排; Row Spacing: 2.54mm; Mounting Type: 直插; Insulation Height: -; Contact Material: 黄铜; Contact Plating: -
JP3 = Header 13: Header, 13-Pin; LatestRevisionDate: 17-Jul-2002; LatestRevisionNote: Re-released for DXP Platform.; Publisher: Altium Limited
JP4 JP5 Signal = KF2EDGR-3.5-10P: Manufacturer: KEFA(科发); Add into BOM: yes; Connector Type: 板端/插座-闭口; Structure: 1x10P; Pitch: 3.5mm; Number of PINs Per Row: 10; Current Rating (Max): 8A; Voltage Rating (Max): 300V; Name: KF2EDGR-3.5-10P; Symbol: KF2EDGR-3.5-10P; Device: KF2EDGR-3.5-10P; LCSC Part Name: 3.5mm 1x10P 排数:1 每排P数:10; Supplier Part: C441168; Manufacturer Part: KF2EDGR-3.5-10P; Supplier Footprint: 弯插,P=3.5mm; JLCPCB Part Class: Extended Part; Datasheet: https://atta.szlcsc.com/upload/public/pdf/source/20230331/72E4E5AAB7D73656319D871C62219080.pdf; Supplier: LCSC; Convert to PCB: yes; Color: 绿色; Mounting Style: 弯针; Number of Pins: 10P; Number of Rows: 1; Operating Temperature Range: -40℃~+105℃
JP6 POWER = KF2EDGR-3.81-2P: Manufacturer: KEFA(科发); Add into BOM: yes; Connector Type: 板端/插座-闭口; Structure: 1x2P; Pitch: 3.81mm; Number of PINs Per Row: 2; Current Rating (Max): 8A; Voltage Rating (Max): 300V; Name: KF2EDGR-3.81-2P; Symbol: KF2EDGR-3.81-2P; Device: KF2EDGR-3.81-2P; LCSC Part Name: 板端/插座-闭口 1x2P 3.81mm 排数:1 每排P数:2 弯针; Supplier Part: C441182; Manufacturer Part: KF2EDGR-3.81-2P; Supplier Footprint: 弯插,P=3.81mm; JLCPCB Part Class: Extended Part; Datasheet: https://atta.szlcsc.com/upload/public/pdf/source/20230331/6258E6C6BF04EFF922F3E5A9E72A4547.pdf; Supplier: LCSC; Convert to PCB: yes; Number of Rows: 1; Mounting Style: 弯针; Operating Temperature Range: -40℃~+105℃; Color: 绿色
R1 R2 R28 = 0603WAF1002T5E: as R3 on sheet AD4111_1; Symbol: 0603WAF1002T5E; Device: 0603WAF1002T5E; LCSC Part Name: 厚膜电阻 10kΩ ±1% 100mW; Supplier Part: C25804; Manufacturer Part: 0603WAF1002T5E; Supplier Footprint: 0603; JLCPCB Part Class: Basic Part; Datasheet: https://atta.szlcsc.com/upload/public/pdf/source/20200306/C422600_1E6D84923E4A46A82E41ADD87F860B5C.pdf; Supplier: LCSC; Convert to PCB: yes; Type: 厚膜电阻; Operating Temperature Range: -55℃~+155℃
U1 = AMS1117-3.3: Manufacturer: IDCHIP(英锐芯); Add into BOM: yes; Name: A1117-3.3; Symbol: A1117-3.3; Device: A1117-3.3; LCSC Part Name: AMS1117-3.3; Supplier Part: C7432020; Manufacturer Part: A1117-3.3; Supplier Footprint: SOT-223; Datasheet: https://atta.szlcsc.com/upload/public/pdf/source/20230625/435FEEFA02C0FE449E7397A11F8448E0.pdf; Supplier: LCSC; Convert to PCB: yes; link: https://atta.szlcsc.com/upload/public/pdf/source/20230625/435FEEFA02C0FE449E7397A11F8448E0.pdf
U2 = MAX3485ESA+T C18148: 485芯片; BOM_Manufacturer: MAXIM; SMT Type: Extend; BOM_Supplier: LCSC; BOM_Manufacturer Part: MAX3485ESA+T; image: //image.lceda.cn/szlcsc/C18148.jpg; BOM_Supplier Part: C18148; BOM_LCSC Assembly: Yes; spicePre: U; URL: https://item.szlcsc.com/18840.html
U5 = MAX3232IDR: Manufacturer: TI(德州仪器); Add into BOM: yes; Types: 收发器; Driver/receiver: 2/2; Data Rate: 250Kbps; Supply Voltage: 3V~5.5V; Name: MAX3232IDR; Symbol: MAX3232IDR; Device: MAX3232IDR; LCSC Part Name: MAX3232IDR; Supplier Part: C18261; Manufacturer Part: MAX3232IDR; Supplier Footprint: SOIC-16; JLCPCB Part Class: Extended Part; Datasheet: https://atta.szlcsc.com/upload/public/pdf/source/20130907/1457706645949.pdf; Supplier: LCSC; Convert to PCB: yes

## Nets that join several sheets
3.3V: AD4111_1 (7 pins), AD4111_2 (7 pins), STM32 (5 pins)
GND: AD4111_1 (29 pins), AD4111_2 (29 pins), STM32 (22 pins)
NetD1_1: AD4111_1 (D1.1 R7.1 R8.1), AD4111_2 (D8.1 R19.1 R20.1)
PB3: AD4111_2 (U4.16), STM32 (JP2.31)
PB4: AD4111_2 (R17.1 U4.14), STM32 (JP2.32)
PB5: AD4111_2 (U4.15), STM32 (JP2.33)
PB12: AD4111_1 (U3.17), STM32 (JP1.30)
PB13: AD4111_1 (U3.16), STM32 (JP1.31)
PB14: AD4111_1 (R5.1 U3.14), STM32 (JP1.32)
PB15: AD4111_1 (U3.15), STM32 (JP1.33)
PD7: AD4111_2 (U4.17), STM32 (JP2.30)
PE0: AD4111_1 (R4.1 U3.19), AD4111_2 (R16.1 U4.19), STM32 (JP2.39)
X1: AD4111_2 (D9.1 R21.1), STM32 (JP3.2 JP4.2)
X2: AD4111_2 (D14.1 R26.1), STM32 (JP3.5 JP4.5)
X3: AD4111_1 (D2.1 R9.1), STM32 (JP3.8 JP4.8)
Y1: AD4111_2 (D10.1 R22.1), STM32 (JP3.3 JP4.3)
Y2: AD4111_2 (D11.1 R23.1), STM32 (JP3.6 JP4.6)
Y3: AD4111_1 (D3.1 R10.1), STM32 (JP3.9 JP4.9)
Z1: AD4111_2 (D13.1 R25.1), STM32 (JP3.4 JP4.4)
Z2: AD4111_2 (D12.1 R24.1), STM32 (JP3.7 JP4.7)
Z3: AD4111_1 (D6.1 R13.1), STM32 (JP3.10 JP4.10)